# Altium schematic sheet Buck Modules.SchDoc
size A3; SheetNumber: 22; SheetTotal: 22
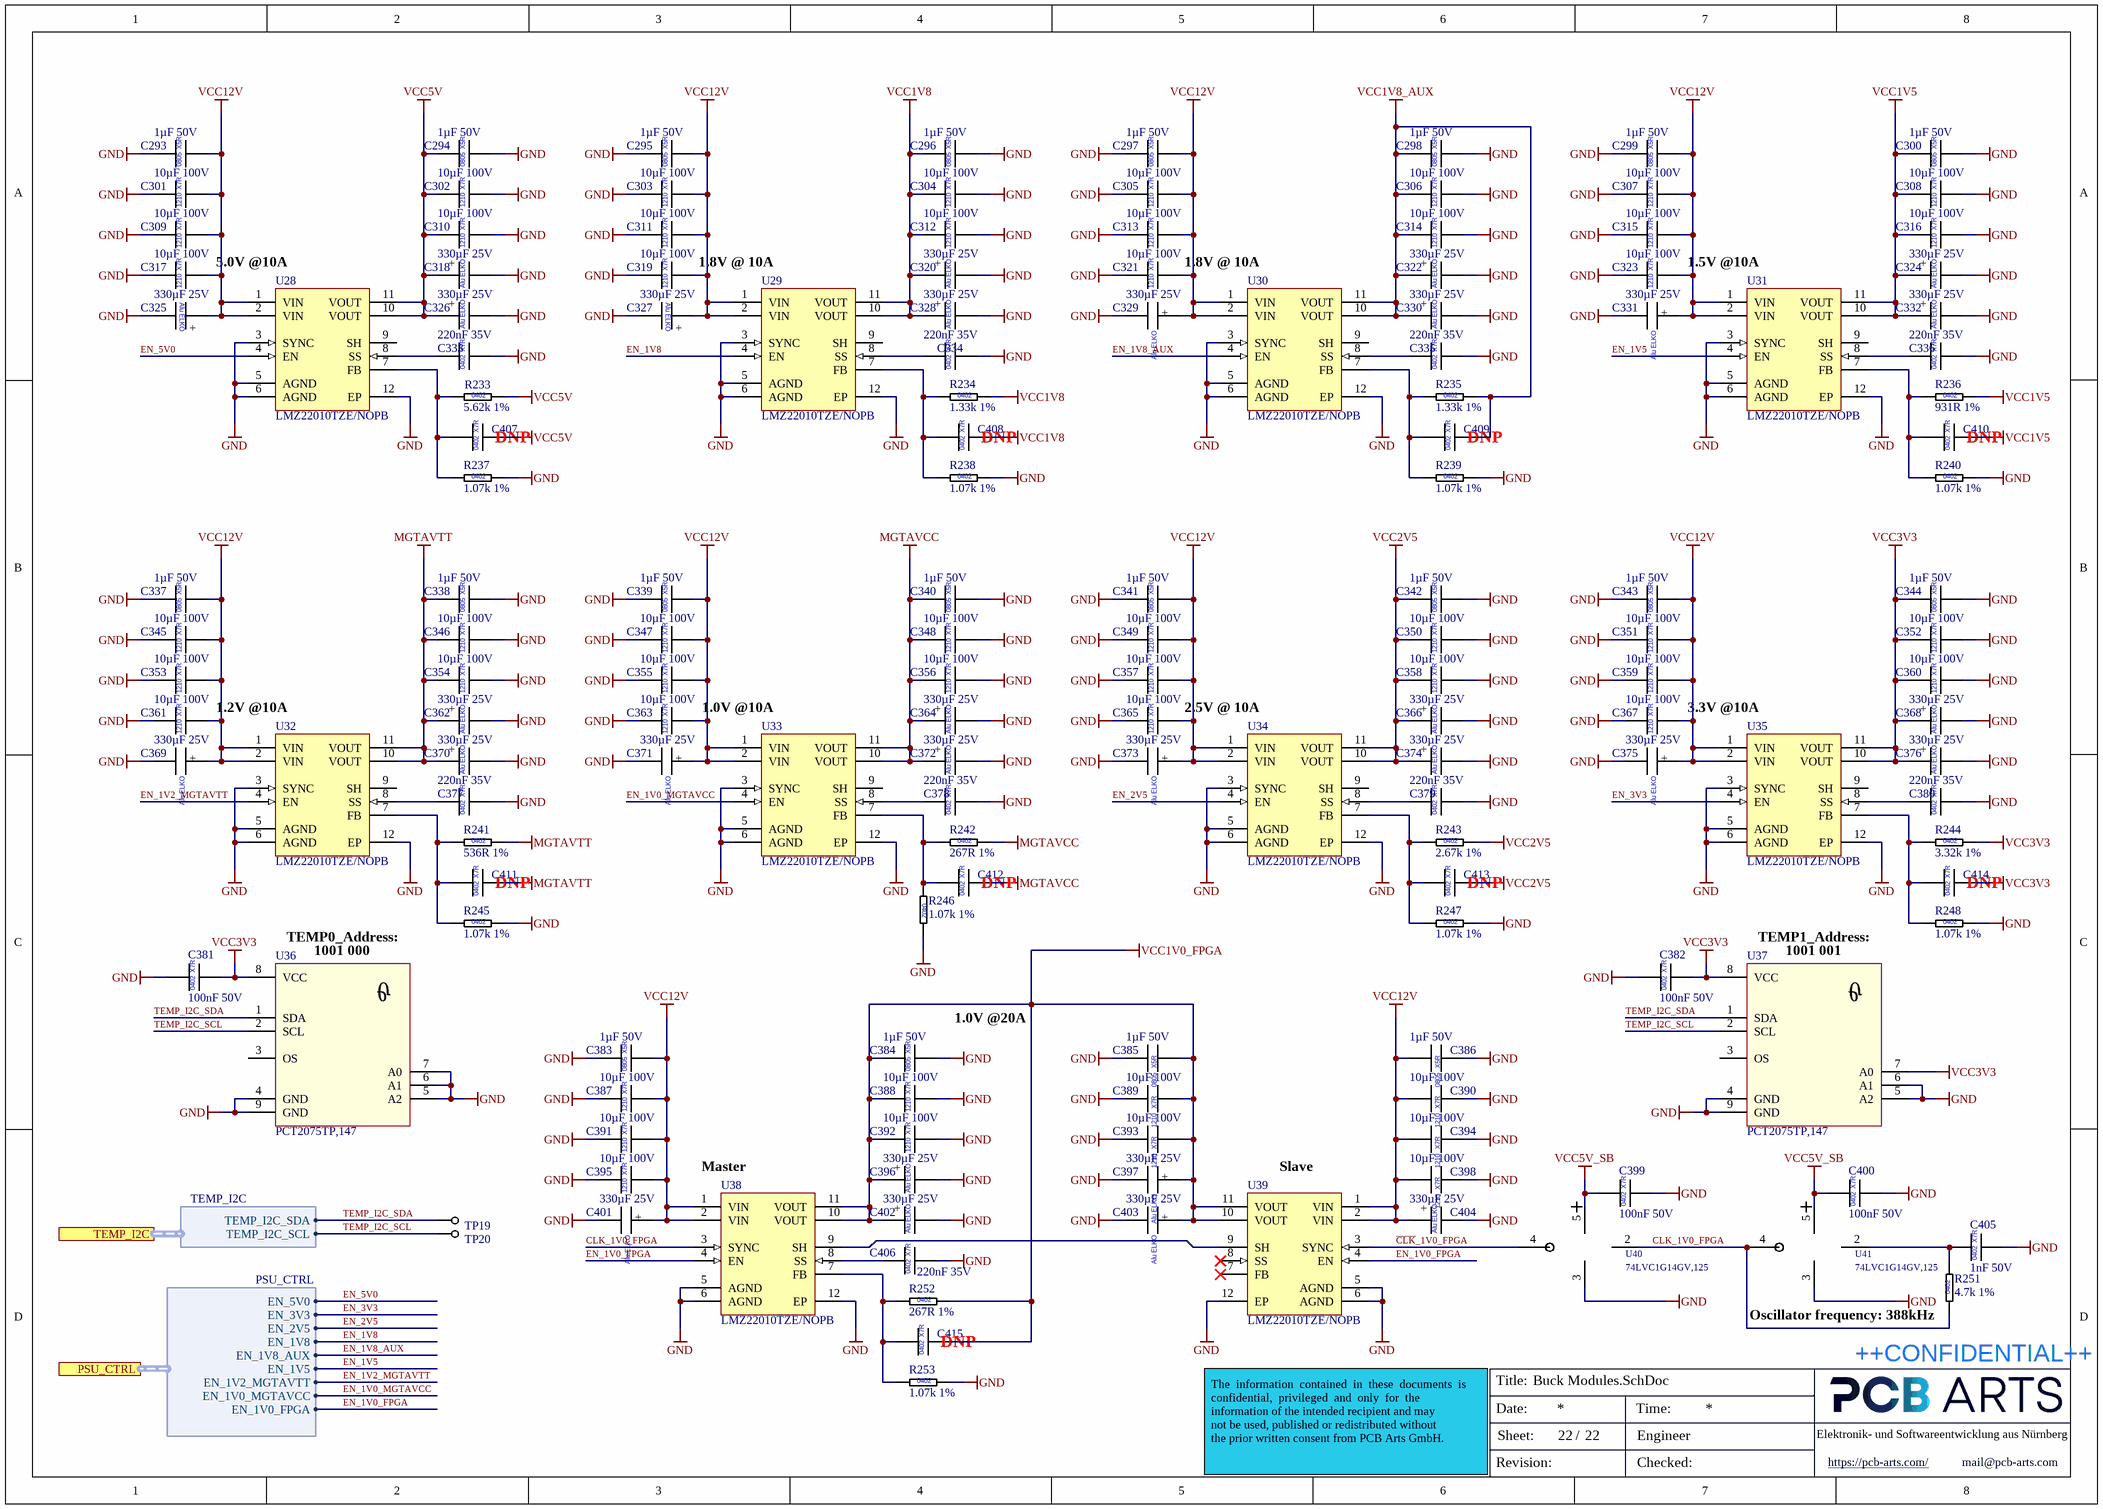
[diagram p0: Buck Modules.SchDoc]

## Parts
C293  1µF 50V  [CAP_0805]
C294  1µF 50V  [CAP_0805]
C295  1µF 50V  [CAP_0805]
C296  1µF 50V  [CAP_0805]
C297  1µF 50V  [CAP_0805]
C298  1µF 50V  [CAP_0805]
C299  1µF 50V  [CAP_0805]
C300  1µF 50V  [CAP_0805]
C301  10µF 100V  [CAP_1210]
C302  10µF 100V  [CAP_1210]
C303  10µF 100V  [CAP_1210]
C304  10µF 100V  [CAP_1210]
C305  10µF 100V  [CAP_1210]
C306  10µF 100V  [CAP_1210]
C307  10µF 100V  [CAP_1210]
C308  10µF 100V  [CAP_1210]
C309  10µF 100V  [CAP_1210]
C310  10µF 100V  [CAP_1210]
C311  10µF 100V  [CAP_1210]
C312  10µF 100V  [CAP_1210]
C313  10µF 100V  [CAP_1210]
C314  10µF 100V  [CAP_1210]
C315  10µF 100V  [CAP_1210]
C316  10µF 100V  [CAP_1210]
C317  10µF 100V  [CAP_1210]
C318  330µF 25V  [WCAP-PTG5_D10H12.5]
C319  10µF 100V  [CAP_1210]
C320  330µF 25V  [WCAP-PTG5_D10H12.5]
C321  10µF 100V  [CAP_1210]
C322  330µF 25V  [WCAP-PTG5_D10H12.5]
C323  10µF 100V  [CAP_1210]
C324  330µF 25V  [WCAP-PTG5_D10H12.5]
C325  330µF 25V  [WCAP-PTG5_D10H12.5]
C326  330µF 25V  [WCAP-PTG5_D10H12.5]
C327  330µF 25V  [WCAP-PTG5_D10H12.5]
C328  330µF 25V  [WCAP-PTG5_D10H12.5]
C329  330µF 25V  [WCAP-PTG5_D10H12.5]
C330  330µF 25V  [WCAP-PTG5_D10H12.5]
C331  330µF 25V  [WCAP-PTG5_D10H12.5]
C332  330µF 25V  [WCAP-PTG5_D10H12.5]
C333  220nF 35V  [CAP_0402_L]
C334  220nF 35V  [CAP_0402_L]
C335  220nF 35V  [CAP_0402_L]
C336  220nF 35V  [CAP_0402_L]
C337  1µF 50V  [CAP_0805]
C338  1µF 50V  [CAP_0805]
C339  1µF 50V  [CAP_0805]
C340  1µF 50V  [CAP_0805]
C341  1µF 50V  [CAP_0805]
C342  1µF 50V  [CAP_0805]
C343  1µF 50V  [CAP_0805]
C344  1µF 50V  [CAP_0805]
C345  10µF 100V  [CAP_1210]
C346  10µF 100V  [CAP_1210]
C347  10µF 100V  [CAP_1210]
C348  10µF 100V  [CAP_1210]
C349  10µF 100V  [CAP_1210]
C350  10µF 100V  [CAP_1210]
C351  10µF 100V  [CAP_1210]
C352  10µF 100V  [CAP_1210]
C353  10µF 100V  [CAP_1210]
C354  10µF 100V  [CAP_1210]
C355  10µF 100V  [CAP_1210]
C356  10µF 100V  [CAP_1210]
C357  10µF 100V  [CAP_1210]
C358  10µF 100V  [CAP_1210]
C359  10µF 100V  [CAP_1210]
C360  10µF 100V  [CAP_1210]
C361  10µF 100V  [CAP_1210]
C362  330µF 25V  [WCAP-PTG5_D10H12.5]
C363  10µF 100V  [CAP_1210]
C364  330µF 25V  [WCAP-PTG5_D10H12.5]
C365  10µF 100V  [CAP_1210]
C366  330µF 25V  [WCAP-PTG5_D10H12.5]
C367  10µF 100V  [CAP_1210]
C368  330µF 25V  [WCAP-PTG5_D10H12.5]
C369  330µF 25V  [WCAP-PTG5_D10H12.5]
C370  330µF 25V  [WCAP-PTG5_D10H12.5]
C371  330µF 25V  [WCAP-PTG5_D10H12.5]
C372  330µF 25V  [WCAP-PTG5_D10H12.5]
C373  330µF 25V  [WCAP-PTG5_D10H12.5]
C374  330µF 25V  [WCAP-PTG5_D10H12.5]
C375  330µF 25V  [WCAP-PTG5_D10H12.5]
C376  330µF 25V  [WCAP-PTG5_D10H12.5]
C377  220nF 35V  [CAP_0402_L]
C378  220nF 35V  [CAP_0402_L]
C379  220nF 35V  [CAP_0402_L]
C380  220nF 35V  [CAP_0402_L]
C381  100nF 50V  [CAP_0402_L]
C382  100nF 50V  [CAP_0402_L]
C383  1µF 50V  [CAP_0805]
C384  1µF 50V  [CAP_0805]
C385  1µF 50V  [CAP_0805]
C386  1µF 50V  [CAP_0805]
C387  10µF 100V  [CAP_1210]
C388  10µF 100V  [CAP_1210]
C389  10µF 100V  [CAP_1210]
C390  10µF 100V  [CAP_1210]
C391  10µF 100V  [CAP_1210]
C392  10µF 100V  [CAP_1210]
C393  10µF 100V  [CAP_1210]
C394  10µF 100V  [CAP_1210]
C395  10µF 100V  [CAP_1210]
C396  330µF 25V  [WCAP-PTG5_D10H12.5]
C397  330µF 25V  [WCAP-PTG5_D10H12.5]
C398  10µF 100V  [CAP_1210]
C399  100nF 50V  [CAP_0402_L]
C400  100nF 50V  [CAP_0402_L]
C401  330µF 25V  [WCAP-PTG5_D10H12.5]
C402  330µF 25V  [WCAP-PTG5_D10H12.5]
C403  330µF 25V  [WCAP-PTG5_D10H12.5]
C404  330µF 25V  [WCAP-PTG5_D10H12.5]
C405  1nF 50V  [CAP_0402_L]
C406  220nF 35V  [CAP_0402_L]
C407  OPT  [CAP_0402_L]  (value not drawn)
C408  OPT  [CAP_0402_L]  (value not drawn)
C409  OPT  [CAP_0402_L]  (value not drawn)
C410  OPT  [CAP_0402_L]  (value not drawn)
C411  OPT  [CAP_0402_L]  (value not drawn)
C412  OPT  [CAP_0402_L]  (value not drawn)
C413  OPT  [CAP_0402_L]  (value not drawn)
C414  OPT  [CAP_0402_L]  (value not drawn)
C415  OPT  [CAP_0402_L]  (value not drawn)
R233  5.62k 1%  [RES_0402_L]
R234  1.33k 1%  [RES_0402_L]
R235  1.33k 1%  [RES_0402_L]
R236  931R 1%  [RES_0402_L]
R237  1.07k 1%  [RES_0402_L]
R238  1.07k 1%  [RES_0402_L]
R239  1.07k 1%  [RES_0402_L]
R240  1.07k 1%  [RES_0402_L]
R241  536R 1%  [RES_0402_L]
R242  267R 1%  [RES_0402_L]
R243  2.67k 1%  [RES_0402_L]
R244  3.32k 1%  [RES_0402_L]
R245  1.07k 1%  [RES_0402_L]
R246  1.07k 1%  [RES_0402_L]
R247  1.07k 1%  [RES_0402_L]
R248  1.07k 1%  [RES_0402_L]
R251  4.7k 1%  [RES_0402_L]
R252  267R 1%  [RES_0402_L]
R253  1.07k 1%  [RES_0402_L]
TP19  Testpoint  [Testpoint 0.8mm]  (value not drawn)  (no BOM)
TP20  Testpoint  [Testpoint 0.8mm]  (value not drawn)  (no BOM)
U28  LMZ22010TZE/NOPB  [TI Simpleswitcher NDY0011A_N]
U29  LMZ22010TZE/NOPB  [TI Simpleswitcher NDY0011A_N]
U30  LMZ22010TZE/NOPB  [TI Simpleswitcher NDY0011A_N]
U31  LMZ22010TZE/NOPB  [TI Simpleswitcher NDY0011A_N]
U32  LMZ22010TZE/NOPB  [TI Simpleswitcher NDY0011A_N]
U33  LMZ22010TZE/NOPB  [TI Simpleswitcher NDY0011A_N]
U34  LMZ22010TZE/NOPB  [TI Simpleswitcher NDY0011A_N]
U35  LMZ22010TZE/NOPB  [TI Simpleswitcher NDY0011A_N]
U36  PCT2075TP,147  [SOT1069-2 (HWSON8)]
U37  PCT2075TP,147  [SOT1069-2 (HWSON8)]
U38  LMZ22010TZE/NOPB  [TI Simpleswitcher NDY0011A_N]
U39  LMZ22010TZE/NOPB  [TI Simpleswitcher NDY0011A_N]
U40  74LVC1G14GV,125  [SOT95P275X110-5N]
U41  74LVC1G14GV,125  [SOT95P275X110-5N]

## Ports
PSU_CTRL (harness PSU_CTRL, see Top-Level-Sheet[6C], PWR_CTRL[1D]), TEMP_I2C (harness TEMP_I2C, see Top-Level-Sheet[6C], SMI Bank 12[1C])

## Harnesses
PSU_CTRL: EN_1V8_AUX, EN_1V5, EN_1V2_MGTAVTT, EN_1V0_MGTAVCC, EN_1V8, EN_1V0_FPGA, EN_2V5, EN_3V3, EN_5V0
TEMP_I2C: TEMP_I2C_SCL, TEMP_I2C_SDA

## Nets
GND: C293.1 C294.2 C295.1 C296.2 C297.1 C298.2 C299.1 C300.2 C301.1 C302.2 C303.1 C304.2 C305.1 C306.2 C307.1 C308.2 C309.1 C310.2 C311.1 C312.2 C313.1 C314.2 C315.1 C316.2 C317.1 C318.2 C319.1 C320.2 C321.1 C322.2 C323.1 C324.2 C325.2 C326.2 C327.2 C328.2 C329.2 C330.2 C331.2 C332.2 C333.2 C334.2 C335.2 C336.2 C337.1 C338.2 C339.1 C340.2 C341.1 C342.2 C343.1 C344.2 C345.1 C346.2 C347.1 C348.2 C349.1 C350.2 C351.1 C352.2 C353.1 C354.2 C355.1 C356.2 C357.1 C358.2 C359.1 C360.2 C361.1 C362.2 C363.1 C364.2 C365.1 C366.2 C367.1 C368.2 C369.2 C370.2 C371.2 C372.2 C373.2 C374.2 C375.2 C376.2 C377.2 C378.2 C379.2 C380.2 C381.1 C382.1 C383.1 C384.2 C385.2 C386.1 C387.1 C388.2 C389.2 C390.1 C391.1 C392.2 C393.2 C394.1 C395.1 C396.2 C397.2 C398.1 C399.2 C400.2 C401.2 C402.2 C403.2 C404.2 C405.2 C406.2 R237.2 R238.2 R239.2 R240.2 R245.2 R246.2 R247.2 R248.2 R253.2 U28.3(SYNC) U28.5(AGND) U28.6(AGND) U28.12(EP) U29.3(SYNC) U29.5(AGND) U29.6(AGND) U29.12(EP) U30.3(SYNC) U30.5(AGND) U30.6(AGND) U30.12(EP) U31.3(SYNC) U31.5(AGND) U31.6(AGND) U31.12(EP) U32.3(SYNC) U32.5(AGND) U32.6(AGND) U32.12(EP) U33.3(SYNC) U33.5(AGND) U33.6(AGND) U33.12(EP) U34.3(SYNC) U34.5(AGND) U34.6(AGND) U34.12(EP) U35.3(SYNC) U35.5(AGND) U35.6(AGND) U35.12(EP) U36.4(GND) U36.5(A2) U36.6(A1) U36.7(A0) U36.9(GND) U37.4(GND) U37.5(A2) U37.6(A1) U37.9(GND) U38.5(AGND) U38.6(AGND) U38.12(EP) U39.5(AGND) U39.6(AGND) U39.12(EP) U40.3(GND) U41.3(GND)
MGTAVCC: C340.1 C348.1 C356.1 C364.1 C372.1 C412.2 R242.2 U33.10(VOUT) U33.11(VOUT)
MGTAVTT: C338.1 C346.1 C354.1 C362.1 C370.1 C411.2 R241.2 U32.10(VOUT) U32.11(VOUT)
VCC1V0_FPGA: C384.1 C385.1 C388.1 C389.1 C392.1 C393.1 C396.1 C397.1 C402.1 C403.1 C415.2 R252.2 U38.10(VOUT) U38.11(VOUT) U39.10(VOUT) U39.11(VOUT)
VCC1V5: C300.1 C308.1 C316.1 C324.1 C332.1 C410.2 R236.2 U31.10(VOUT) U31.11(VOUT)
VCC1V8: C296.1 C304.1 C312.1 C320.1 C328.1 C408.2 R234.2 U29.10(VOUT) U29.11(VOUT)
VCC1V8_AUX: C298.1 C306.1 C314.1 C322.1 C330.1 C409.2 R235.2 U30.10(VOUT) U30.11(VOUT)
VCC2V5: C342.1 C350.1 C358.1 C366.1 C374.1 C413.2 R243.2 U34.10(VOUT) U34.11(VOUT)
VCC3V3: C344.1 C352.1 C360.1 C368.1 C376.1 C381.2 C382.2 C414.2 R244.2 U35.10(VOUT) U35.11(VOUT) U36.8(VCC) U37.7(A0) U37.8(VCC)
VCC5V: C294.1 C302.1 C310.1 C318.1 C326.1 C407.2 R233.2 U28.10(VOUT) U28.11(VOUT)
VCC5V_SB: C399.1 C400.1 U40.5(VCC) U41.5(VCC)
VCC12V: C293.2 C295.2 C297.2 C299.2 C301.2 C303.2 C305.2 C307.2 C309.2 C311.2 C313.2 C315.2 C317.2 C319.2 C321.2 C323.2 C325.1 C327.1 C329.1 C331.1 C337.2 C339.2 C341.2 C343.2 C345.2 C347.2 C349.2 C351.2 C353.2 C355.2 C357.2 C359.2 C361.2 C363.2 C365.2 C367.2 C369.1 C371.1 C373.1 C375.1 C383.2 C386.2 C387.2 C390.2 C391.2 C394.2 C395.2 C398.2 C401.1 C404.1 U28.1(VIN) U28.2(VIN) U29.1(VIN) U29.2(VIN) U30.1(VIN) U30.2(VIN) U31.1(VIN) U31.2(VIN) U32.1(VIN) U32.2(VIN) U33.1(VIN) U33.2(VIN) U34.1(VIN) U34.2(VIN) U35.1(VIN) U35.2(VIN) U38.1(VIN) U38.2(VIN) U39.1(VIN) U39.2(VIN)
~{CLK}_1V0_FPGA: U39.3(SYNC) U40.4(Y)
CLK_1V0_FPGA: R251.1 U38.3(SYNC) U40.2(A) U41.4(Y)
EN_1V0_FPGA: U38.4(EN) U39.4(EN) ; port PSU_CTRL.EN_1V0_FPGA
EN_1V0_MGTAVCC: U33.4(EN) ; port PSU_CTRL.EN_1V0_MGTAVCC
EN_1V2_MGTAVTT: U32.4(EN) ; port PSU_CTRL.EN_1V2_MGTAVTT
EN_1V5: U31.4(EN) ; port PSU_CTRL.EN_1V5
EN_1V8: U29.4(EN) ; port PSU_CTRL.EN_1V8
EN_1V8_AUX: U30.4(EN) ; port PSU_CTRL.EN_1V8_AUX
EN_2V5: U34.4(EN) ; port PSU_CTRL.EN_2V5
EN_3V3: U35.4(EN) ; port PSU_CTRL.EN_3V3
EN_5V0: U28.4(EN) ; port PSU_CTRL.EN_5V0
TEMP_I2C_SCL: TP20.1(GND) U36.2(SCL) U37.2(SCL) ; port TEMP_I2C.TEMP_I2C_SCL
TEMP_I2C_SDA: TP19.1(GND) U36.1(SDA) U37.1(SDA) ; port TEMP_I2C.TEMP_I2C_SDA
NetC333_1: C333.1 U28.8(SS)
NetC334_1: C334.1 U29.8(SS)
NetC335_1: C335.1 U30.8(SS)
NetC336_1: C336.1 U31.8(SS)
NetC377_1: C377.1 U32.8(SS)
NetC378_1: C378.1 U33.8(SS)
NetC379_1: C379.1 U34.8(SS)
NetC380_1: C380.1 U35.8(SS)
NetC405_1: C405.1 R251.2 U41.2(A)
NetC406_1: C406.1 U38.8(SS)
NetC407_1: C407.1 R233.1 R237.1 U28.7(FB)
NetC408_1: C408.1 R234.1 R238.1 U29.7(FB)
NetC409_1: C409.1 R235.1 R239.1 U30.7(FB)
NetC410_1: C410.1 R236.1 R240.1 U31.7(FB)
NetC411_1: C411.1 R241.1 R245.1 U32.7(FB)
NetC412_1: C412.1 R242.1 R246.1 U33.7(FB)
NetC413_1: C413.1 R243.1 R247.1 U34.7(FB)
NetC414_1: C414.1 R244.1 R248.1 U35.7(FB)
NetC415_1: C415.1 R252.1 R253.1 U38.7(FB)
NetU38_9: U38.9(SH) U39.9(SH)

Not connected (* = marked no-connect by the designer): U28 9(SH); U29 9(SH); U30 9(SH); U31 9(SH); U32 9(SH); U33 9(SH); U34 9(SH); U35 9(SH); U36 3(OS); U37 3(OS); U39 7(FB)* 8(SS)*

## Notes on the sheet
- (near U28) 5.0V @10A
- (near U29) 1.8V @ 10A
- (near U30) 1.8V @ 10A
- (near U31) 1.5V @10A
- (near C407) DNP
- (near C408) DNP
- (near C409) DNP
- (near C410) DNP
- (near U32) 1.2V @10A
- (near U33) 1.0V @10A
- (near U34) 2.5V @ 10A
- (near U35) 3.3V @10A
- (near C411) DNP
- (near C412) DNP
- (near C413) DNP
- (near C414) DNP
- (near U36) TEMP0_Address:
- (near U36) 1001 000
- (near U37) TEMP1_Address:
- (near U37) 1001 001
- 1.0V @20A
- (near U38) Master
- (near U39) Slave
- (near R251) Oscillator frequency: 388kHz
- (near C415) DNP
- Title:
- ++CONFIDENTIAL++
- Date:
- Sheet:
- /
- Time:
- Engineer
- Elektronik- und Softwareentwicklung aus Nürnberg
- The  information  contained  in  these  documents  is  confidential,  privileged  and  only  for  the
  information of the intended recipient and may
  not be used, published or redistributed without
  the prior written consent from PCB Arts GmbH.
- Revision:
- Checked:
- https://pcb-arts.com/
- mail@pcb-arts.com
- (in symbol CAP_0402_1nF_50V) X7R; 0402
- (in symbol CAP_0402_100nF_50V) X7R; 0402
- (in symbol CAP_0402_220nF_35V) X7R; 0402
- (in symbol CAP_0402_OPT) X7R; 0402
- (in symbol CAP_0805_1µF_50V) X5R; 0805
- (in symbol CAP_1210_10µF_100V) X7R; 1210
- (in symbol CAP_D10L12.5_330µF_25V) Alu ELKO; +
- (in symbol PCT2075TP,147) ϑ
- (in symbol RES_0402_1.07k_1%) 0402
- (in symbol RES_0402_1.33k_1%) 0402
- (in symbol RES_0402_2.67k_1%) 0402
- (in symbol RES_0402_3.32k_1%) 0402
- (in symbol RES_0402_4.7k_1%) 0402
- (in symbol RES_0402_5.62k_1%) 0402
- (in symbol RES_0402_267R_1%) 0402
- (in symbol RES_0402_536R_1%) 0402
- (in symbol RES_0402_931R_1%) 0402

## Library data of the parts
C293-C300 C337-C344 C383-C386 = CAP_0805_1µF_50V: Multilayer Ceramic Capacitors MLCC - SMD/SMT 0805 50VDC; Manufacturer 1: Samsung Electro-Mechanics; Manufacturer 1 Prt. Nr.: CL21B105KBFNNNG; Manufacturer 2 Prt. Nr.: UMK212BJ105KGHT; Manufacturer 2: Taiyo Yuden
C301-C317 C319 C321 C323 C345-C361 C363 C365 C367 C387-C395 C398 = CAP_1210_10µF_100V: Multilayer Ceramic Capacitors MLCC - SMD/SMT 1210 100VDC; Manufacturer 1: Murata Electronics; Manufacturer 1 Prt. Nr.: GRM32EC72A106ME05L; Manufacturer 2 Prt. Nr.: C3225X7R2A106K250AC; Manufacturer 2: TDK
C318 C320 C322 C324-C332 C362 C364 C366 C368-C376 C396 C397 C401-C404 = CAP_D10L12.5_330µF_25V: Organische Polymer-Aluminiumkondensatoren 330uF 25 Volts 20% AEC-Q200; Manufacturer 1: Würth Elektronik; Manufacturer 1 Prt. Nr.: 870025575009
C333-C336 C377-C380 C406 = CAP_0402_220nF_35V: Multilayer Ceramic Capacitors MLCC - SMD/SMT 0402 35VDC; Manufacturer 1: Murata Electronics; Manufacturer 1 Prt. Nr.: GCM155R71C224ME02D; Manufacturer 2 Prt. Nr.: 885012105017; Manufacturer 2: Wurth Elektronik
C381 C382 C399 C400 = CAP_0402_100nF_50V: Multilayer Ceramic Capacitors MLCC - SMD/SMT 0402 50VDC; Manufacturer 1: Murata Electronics; Manufacturer 1 Prt. Nr.: GCM155L8EH104KE07D; Manufacturer 2 Prt. Nr.: UMK105B7104KV-FR; Manufacturer 2: TDK
C405 = CAP_0402_1nF_50V: Multilayer Ceramic Capacitors MLCC - SMD/SMT 0402 50VDC; Manufacturer 1: Murata Electronics; Manufacturer 1 Prt. Nr.: GRM155R71H102JA01D; Manufacturer 2 Prt. Nr.: C0402C102J5RAC7411; Manufacturer 2: KEMET
C407-C415 = CAP_0402_OPT: Multilayer Ceramic Capacitors MLCC - SMD/SMT 0402 Optional Placeholder
R233 = RES_0402_5.62k_1%: Thick Film Resistors - SMD 5.62kOhm 1%; Manufacturer 1: Vishay / Dale; Manufacturer 1 Prt. Nr.: CRCW04025K62FKEDC; Manufacturer 2 Prt. Nr.: AC0402FR-7W5K62L; Manufacturer 2: Yageo
R234 R235 = RES_0402_1.33k_1%: Thick Film Resistors - SMD 1.33kOhm 1%; Manufacturer 1: Vishay / Dale; Manufacturer 1 Prt. Nr.: CRCW04021K33FKEDC; Manufacturer 2 Prt. Nr.: AC0402FR-071K33L; Manufacturer 2: Yageo
R236 = RES_0402_931R_1%: Thick Film Resistors - SMD 931Ohm 1%; Manufacturer 1: Vishay / Dale; Manufacturer 1 Prt. Nr.: CRCW0402931RFKED; Manufacturer 2 Prt. Nr.: RC0402FR-07931RL; Manufacturer 2: Yageo
R237-R240 R245-R248 R253 = RES_0402_1.07k_1%: Thick Film Resistors - SMD 1.07kOhm 1%; Manufacturer 1: Vishay / Dale; Manufacturer 1 Prt. Nr.: CRCW04021K07FKEDC; Manufacturer 2 Prt. Nr.: AC0402FR-071K07L; Manufacturer 2: Yageo
R241 = RES_0402_536R_1%: Thick Film Resistors - SMD 536Ohm 1%; Manufacturer 1: Vishay / Dale; Manufacturer 1 Prt. Nr.: CRCW0402536RFKED; Manufacturer 2 Prt. Nr.: RC0402FR-07536RL; Manufacturer 2: Yageo
R242 R252 = RES_0402_267R_1%: Thick Film Resistors - SMD 267Ohm 1%; Manufacturer 1: Vishay / Dale; Manufacturer 1 Prt. Nr.: CRCW0402267RFKED; Manufacturer 2 Prt. Nr.: RC0402FR-07267RL; Manufacturer 2: Yageo
R243 = RES_0402_2.67k_1%: Thick Film Resistors - SMD 2.67kOhm 1%; Manufacturer 1: Vishay / Dale; Manufacturer 1 Prt. Nr.: CRCW04022K67FKEDC; Manufacturer 2 Prt. Nr.: AC0402FR-072K67L; Manufacturer 2: Yageo
R244 = RES_0402_3.32k_1%: Thick Film Resistors - SMD 3.32kOhm 1%; Manufacturer 1: Vishay / Dale; Manufacturer 1 Prt. Nr.: CRCW04023K32FKEDC; Manufacturer 2 Prt. Nr.: AC0402FR-073K32L; Manufacturer 2: Yageo
R251 = RES_0402_4.7k_1%: Thick Film Resistors - SMD 4.7kOhm 1%; Manufacturer 1: Vishay / Dale; Manufacturer 1 Prt. Nr.: CRCW04024K70FKEDC; Manufacturer 2 Prt. Nr.: RC0402FR-134K7L; Manufacturer 2: Yageo
TP19 TP20 = Testpoint 0.8mm
U28-U35 U38 U39 = LMZ22010TZE/NOPB_Power Module with 20V Maximum Input and Current Sharing: 10A SIMPLE SWITCHER® Power Module with 20V Maximum Input and Current Sharing; Manufacturer 1: Texas Instruments; ComponentLink1URL: http://www.ti.com/general/docs/lit/getliterature.tsp?genericPartNumber=LMZ22010&fileType=pdf; ComponentLink1Description: Datasheet URL; Manufacturer 1 Prt. Nr.: LMZ22010TZE/NOPB
U36 U37 = PCT2075TP,147: Digital Temp Sensor I2C; Manufacturer 1: NXP; Manufacturer 1 Prt. Nr.: PCT2075TP,147
U40 U41 = 74LVC1G14GV,125_Inverter Single inverting Schmitt trigger: Inverter Single inverting Schmitt trigger; Manufacturer 1: Nexperia; Manufacturer 1 Prt. Nr.: 74LVC1G14GV,125